# EAGLE design Zio Qwiic LoRa Dev Board (EAGLE 9.1.1)
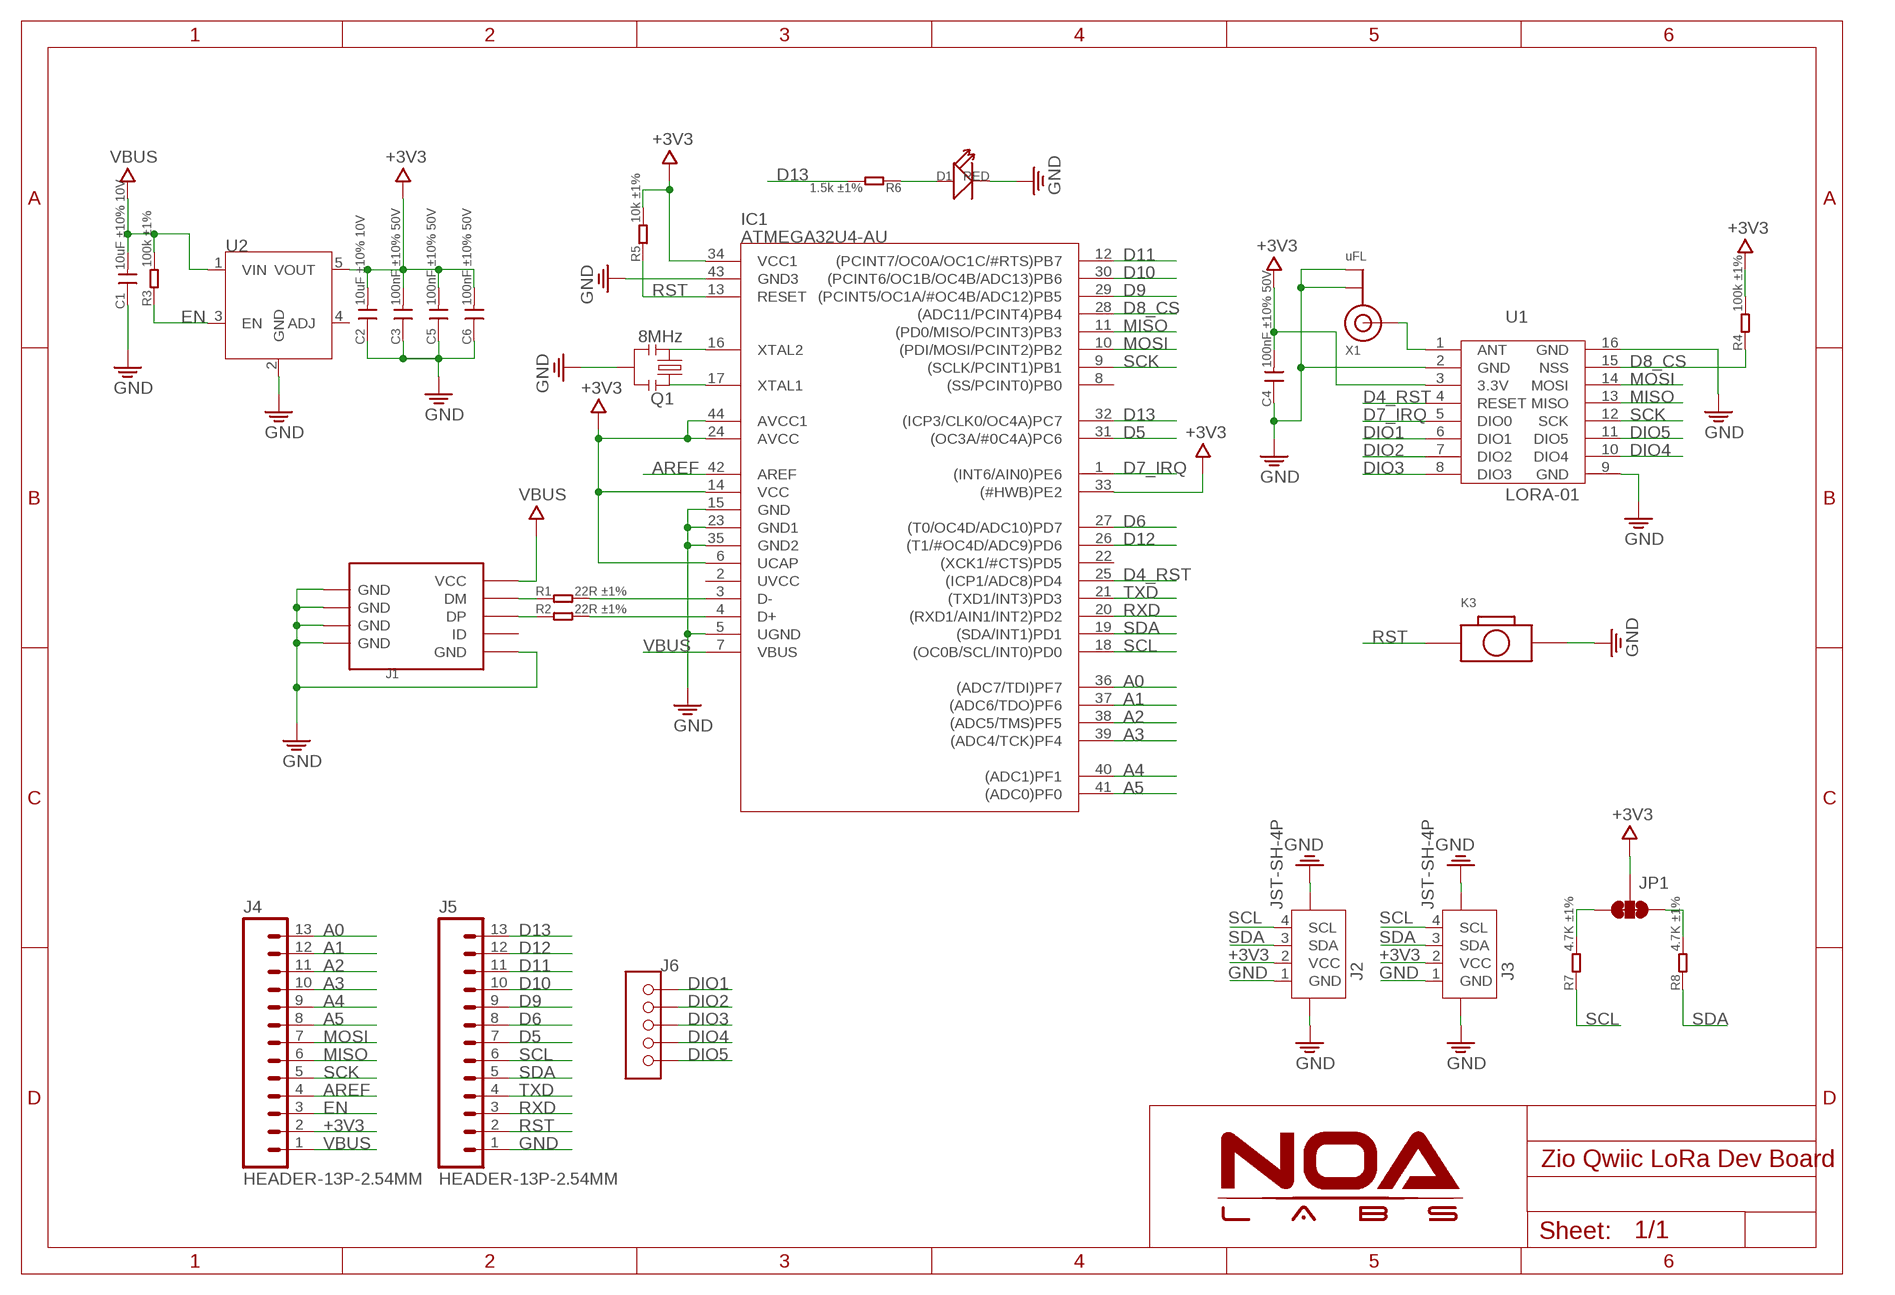
[diagram p0: schematic, sheet 1]

## Parts
C1  10uF ±10% 10V  C-0603  [C0603]
C2  10uF ±10% 10V  C-0603  [C0603]
C3  100nF ±10% 50V  C-0603  [C0603]
C4  100nF ±10% 50V  C-0603  [C0603]
C5  100nF ±10% 50V  C-0603  [C0603]
C6  100nF ±10% 50V  C-0603  [C0603]
D1  RED  LED'0603'  [LED-0603]
IC1  ATMEGA32U4-AU  ATMEGA32U4  [TQFP44]
J1  USB-MICROE  [MICRO-SMD]
J2  JST-SH-4P  [JST-SH-4P-90]
J3  JST-SH-4P  [JST-SH-4P-90]
J4  HEADER-13P-2.54MM  [13P-SCREW-2.54]
J5  HEADER-13P-2.54MM  [13P-SCREW-2.54]
J6  HEADER-5P-2.54  [5P-2.54]
JP1  SMT-JUMPER_3_2-NC_TRACE  [SMT-JUMPER_3_2-NC_TRACE]
K3  BOTTON-2PSKRKAEE020  [SKRKAEE020]
Q1  8MHz  RESONATORSMD  [RESONATOR-SMD]
R1  22R ±1%  R-0603  [R0603]
R2  22R ±1%  R-0603  [R0603]
R3  100k ±1%  R-0603  [R0603]
R4  100k ±1%  R-0603  [R0603]
R5  10k ±1%  R-0603  [R0603]
R6  1.5k ±1%  R-0603  [R0603]
R7  4.7K ±1%  R-0603  [R0603]
R8  4.7K ±1%  R-0603  [R0603]
U1  LORA-01  [LORA-01]
U2  AP2112  [SOT23-5]
X1  uFL  ANTENNA_U.FL  [U.FL]

## Nets
+3V3: C2.2 C3.2 C4.2 C5.2 C6.2 IC1.6(UCAP) IC1.14(VCC) IC1.24(AVCC) IC1.33((#HWB)PE2) IC1.34(VCC1) IC1.44(AVCC1) J2.2(VCC) J3.2(VCC) J4.2 JP1.2 R4.2 R5.2 U1.3(3.3V) U2.5(VOUT)
A0: IC1.36((ADC7/TDI)PF7) J4.13
A1: IC1.37((ADC6/TDO)PF6) J4.12
A2: IC1.38((ADC5/TMS)PF5) J4.11
A3: IC1.39((ADC4/TCK)PF4) J4.10
A4: IC1.40((ADC1)PF1) J4.9
A5: IC1.41((ADC0)PF0) J4.8
AREF: IC1.42(AREF) J4.4
D4_RST: IC1.25((ICP1/ADC8)PD4) U1.4(RESET)
D5: IC1.31((OC3A/#0C4A)PC6) J5.7
D6: IC1.27((T0/OC4D/ADC10)PD7) J5.8
D7_IRQ: IC1.1((INT6/AIN0)PE6) U1.5(DIO0)
D8_CS: IC1.28((ADC11/PCINT4)PB4) R4.1 U1.15(NSS)
D9: IC1.29((PCINT5/OC1A/#OC4B/ADC12)PB5) J5.9
D10: IC1.30((PCINT6/OC1B/OC4B/ADC13)PB6) J5.10
D11: IC1.12((PCINT7/OC0A/OC1C/#RTS)PB7) J5.11
D12: IC1.26((T1/#OC4D/ADC9)PD6) J5.12
D13: IC1.32((ICP3/CLK0/OC4A)PC7) J5.13 R6.2
DIO1: J6.1 U1.6(DIO1)
DIO2: J6.2 U1.7(DIO2)
DIO3: J6.3 U1.8(DIO3)
DIO4: J6.4 U1.10(DIO4)
DIO5: J6.5 U1.11(DIO5)
EN: J4.3 R3.1 U2.3(EN)
GND: C1.1 C2.1 C3.1 C4.1 C5.1 C6.1 D1.- IC1.5(UGND) IC1.15(GND) IC1.23(GND1) IC1.35(GND2) IC1.43(GND3) J1.GND J1.S1(GND) J1.S1@1(GND) J1.S1@2(GND) J1.S2(GND) J1.S2@1(GND) J1.S2@2(GND) J1.S3(GND) J1.S3@1(GND) J1.S3@2(GND) J1.S4(GND) J1.S4@1(GND) J1.S4@2(GND) J1.S5(GND) J1.S6(GND) J2.1(GND) J2.5 J2.6 J3.1(GND) J3.5 J3.6 J5.1 K3.2 Q1.2 U1.2(GND) U1.9(GND) U1.16(GND) U2.2(GND) X1.1(GND) X1.2(GND)
MISO: IC1.11((PD0/MISO/PCINT3)PB3) J4.6 U1.13(MISO)
MOSI: IC1.10((PDI/MOSI/PCINT2)PB2) J4.7 U1.14(MOSI)
N$1: J1.D-(DM) R1.1
N$2: J1.D+(DP) R2.1
N$3: IC1.4(D+) R2.2
N$4: IC1.3(D-) R1.2
N$6: IC1.16(XTAL2) Q1.3
N$7: D1.+ R6.1
N$8: IC1.17(XTAL1) Q1.1
N$18: U1.1(ANT) X1.3(SIGNAL)
N$34: JP1.3 R7.2
N$36: JP1.1 R8.2
RST: IC1.13(RESET) J5.2 K3.1 R5.1
RXD: IC1.20((RXD1/AIN1/INT2)PD2) J5.3
SCK: IC1.9((SCLK/PCINT1)PB1) J4.5 U1.12(SCK)
SCL: IC1.18((OC0B/SCL/INT0)PD0) J2.4(SCL) J3.4(SCL) J5.6 R7.1
SDA: IC1.19((SDA/INT1)PD1) J2.3(SDA) J3.3(SDA) J5.5 R8.1
TXD: IC1.21((TXD1/INT3)PD3) J5.4
VBUS: C1.2 IC1.7(VBUS) J1.VBUS(VCC) J4.1 R3.2 U2.1(VIN)
Unconnected: IC1.2(UVCC) IC1.8((SS/PCINT0)PB0) IC1.22((XCK1/#CTS)PD5) J1.ID U2.4(ADJ)

## Library data of the parts
C1-C6 = RCL:C
D1 = Discrete_NOA:LED*
IC1 = IC:ATMEGA32U4
J1 = Connector_NOA:USB-MICROE
J2 J3 = Connector:JST-SH-4P
J4 J5 = Connector:HEADER-13P
J6 = Connector:HEADER-5P
JP1 = NOA-Jumpers:SMT-JUMPER_3_2-NC_TRACE
K3 = Discrete:BOTTON-2P
Q1 = SparkFun:RESONATOR: Resonator Small SMD resonator. This is the itty bitty 10/20MHz resonators with built in caps. CSTCE10M0G55 and CSTCE20M0V53. Footprint has been reviewed closely but hasn't been tested yet.
R1-R8 = RCL:R
U1 = IC:LORA-01
U2 = IC_NOA:AP2112
X1 = microbuilder:ANTENNA_U.FL: U.FL Antenna Connector

## Board
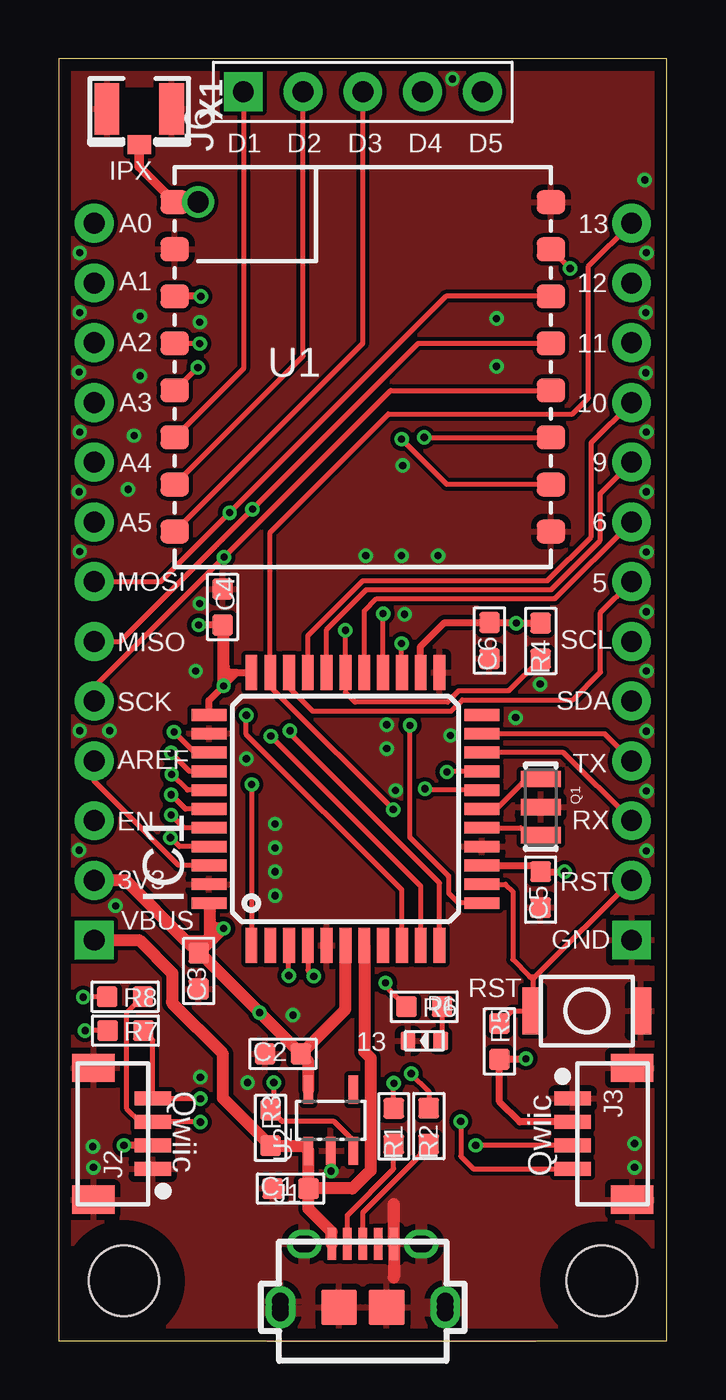
[diagram p1: board, top side]
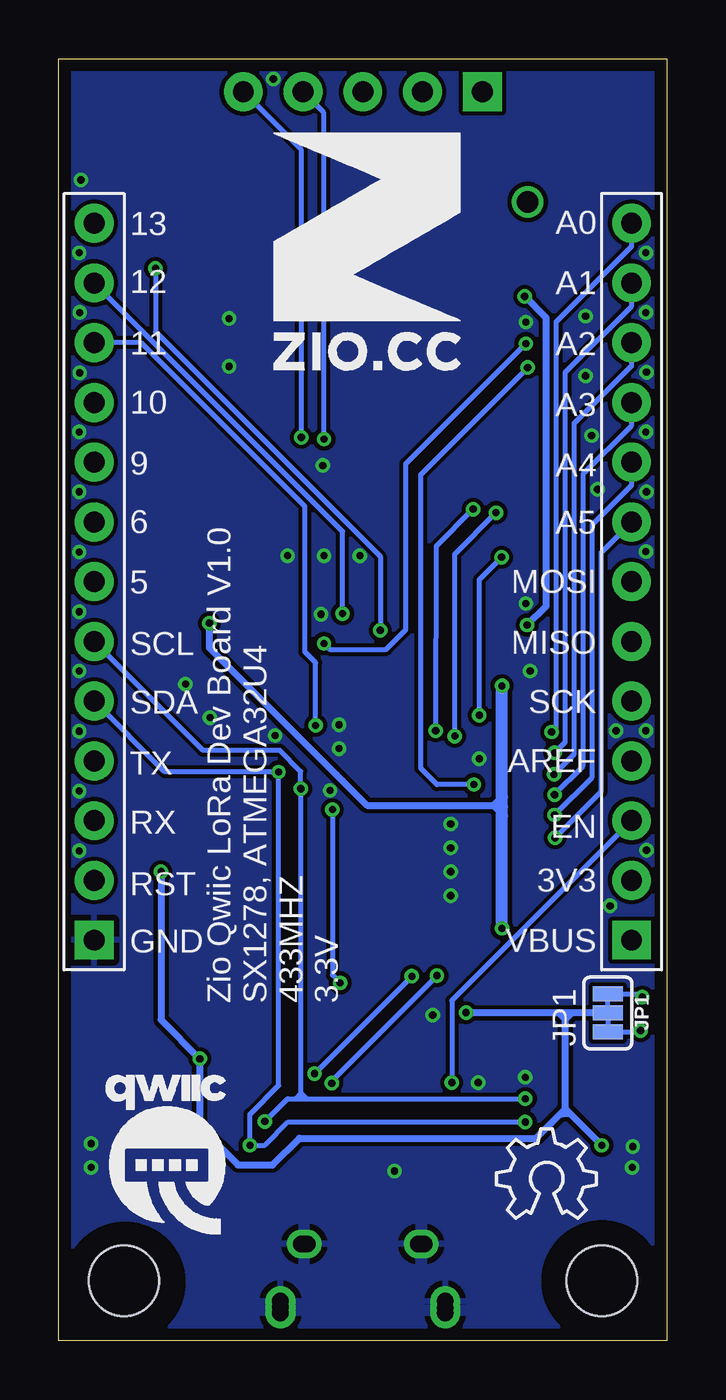
[diagram p2: board, bottom side, seen from below]

Size 25.86 x 54.5 mm. Coordinates in mm from the lower left corner, seen from the top.
Outline: 0,0 25.86,0 25.86,54.5 0,54.5 0,0
Copper layers (1*16): Top 0.035mm / dielectric 1.5mm / Bottom 0.035mm
Design rules "NOA Eagle Rule": minimum track width 7mil, minimum drill 12mil, track to track 7mil, track to pad 7mil, pad to pad 7mil, via to via 7mil, smd to smd 0mil, copper to edge 20mil, drill to drill 10mil, minimum pad ring 10mil, minimum via ring 6mil, stop-mask expansion 2mil, vias tented up to drill 25mil, thermal gap 10mil
Holes 3 mm at 2.77,2.54 23.09,2.54
tRestrict: area 0.3,0 to 5.3,5; area 20.6,0 to 25.6,5
bRestrict: area 0.3,0 to 5.3,5; area 20.6,0 to 25.6,5

### Footprints (pad centres in the part's own frame; a part is rotated, then mirrored left to right if it is on the bottom)
C0603 = smd 0.889 x 0.889: 1 -0.762,0; 2 0.762,0
LED-0603 = smd 0.635 x 0.8: + 0.699,0; - -0.699,0
TQFP44 = smd 1.5 x 0.5: 1 -5.8,4; 2 -5.8,3.2; 3 -5.8,2.4; 4 -5.8,1.6; 5 -5.8,0.8; 6 -5.8,0; 7 -5.8,-0.8; 8 -5.8,-1.6; 9 -5.8,-2.4; 10 -5.8,-3.2; 11 -5.8,-4; 23 5.8,-4; 24 5.8,-3.2; 25 5.8,-2.4; 26 5.8,-1.6; 27 5.8,-0.8; 28 5.8,0; 29 5.8,0.8; 30 5.8,1.6; 31 5.8,2.4; 32 5.8,3.2; 33 5.8,4 | smd 0.5 x 1.5: 12 -4,-5.8; 13 -3.2,-5.8; 14 -2.4,-5.8; 15 -1.6,-5.8; 16 -0.8,-5.8; 17 0,-5.8; 18 0.8,-5.8; 19 1.6,-5.8; 20 2.4,-5.8; 21 3.2,-5.8; 22 4,-5.8; 34 4,5.8; 35 3.2,5.8; 36 2.4,5.8; 37 1.6,5.8; 38 0.8,5.8; 39 0,5.8; 40 -0.8,5.8; 41 -1.6,5.8; 42 -2.4,5.8; 43 -3.2,5.8; 44 -4,5.8
MICRO-SMD = smd 0.406 x 1.346: D+ 0,2.057; D- -0.66,2.057; GND 1.321,2.057; ID 0.66,2.057; VBUS -1.321,2.057 | drill 0.7: S1 -2.489,2.057; S1@1 -2.616,2.057; S1@2 -2.362,2.057; S2 2.464,2.057; S2@1 2.362,2.057; S2@2 2.616,2.057 | drill 0.7 pad 1.27: S3 -3.505,-0.66; S3@1 -3.505,-0.381; S3@2 -3.505,-0.889; S4 3.505,-0.635; S4@1 3.505,-0.381; S4@2 3.505,-0.889 | smd 1.524 x 1.524: S5 -1.016,-0.635; S6 1.016,-0.635
JST-SH-4P-90 = smd 0.6 x 1.55: 1 -1.5,0; 2 -0.5,0; 3 0.5,0; 4 1.5,0 | smd 1.2 x 1.8: 5 -2.8,2.525; 6 2.8,2.525
13P-SCREW-2.54 = drill 0.889 pad 1.651 square: 1 0,13.97 | drill 0.889 pad 1.651: 2 0,11.43; 3 0,8.89; 4 0,6.35; 5 0,3.81; 6 0,1.27; 7 0,-1.27; 8 0,-3.81; 9 0,-6.35; 10 0,-8.89; 11 0,-11.43; 12 0,-13.97; 13 0,-16.51
5P-2.54 = drill 0.889 pad 1.651 square: 1 0,5.08 | drill 0.889 pad 1.651: 2 0,2.54; 3 0,0; 4 0,-2.54; 5 0,-5.08
SMT-JUMPER_3_2-NC_TRACE = smd 0.635 x 1.27: 1 -0.813,0; 2 0,0; 3 0.813,0
SKRKAEE020 = smd 0.87 x 2: 1 -2.3,0; 2 2.3,0
RESONATOR-SMD = smd 0.7 x 1.7: 1 -1.2,0; 2 0,0; 3 1.2,0
R0603 = smd 0.889 x 0.889: 1 -0.762,0; 2 0.762,0
LORA-01 = smd 1.2 x 1: 1 -8,7; 2 -8,5; 3 -8,3; 4 -8,1; 5 -8,-1; 6 -8,-3; 7 -8,-5; 8 -8,-7; 9 8,-7; 10 8,-5; 11 8,-3; 12 8,-1; 13 8,1; 14 8,3; 15 8,5; 16 8,7
SOT23-5 = smd 0.4 x 1.2: 1 -0.95,-1.3; 2 0,-1.3; 3 0.95,-1.3; 4 0.95,1.3; 5 -0.95,1.3
U.FL = smd 2.2 x 1.05: 1 0,1.375; 2 0,-1.375 | smd 0.8 x 1: 3 1.525,0

### Placement (x,y rotation side)
C1  9.86,6.47 0 top
C2  9.53,12.19 0 top
C3  5.95,15.72 90 top
C4  6.97,31.19 270 top
C5  20.49,19.18 90 top
C6  18.32,29.77 90 top
D1  15.54,12.75 0 top
IC1  12.19,22.61 90 top
J1  12.93,2.06 0 top
J2  4,8.8 90 top
J3  21.86,8.8 270 top
J4  1.5,31 180 bottom
J5  24.36,31 180 bottom
J6  12.93,53.09 90 top
JP1  2.51,13.93 270 bottom
K3  22.46,14.01 0 top
Q1  20.5,22.68 270 top
R1  14.24,9.11 90 top
R2  15.74,9.12 90 top
R3  9.01,9.05 270 top
R4  20.5,29.75 90 top
R5  18.74,12.72 270 top
R6  15.54,14.2 180 top
R7  2.84,13.18 180 top
R8  2.82,14.62 180 top
U1  12.93,41.4 0 top
U2  11.57,9.38 0 top
U$10  [10MM]  16.74,41.27 0 bottom
U$11  [QWIIC-LOGO-MEDIUM]  21.31,7.98 0 bottom
U$12  [OSHW_6X150_NOTEXT]  7.24,5.21 0 bottom
X1  3.42,52.37 270 top

### Tracks (layer width: path | path; a pad name or v marks a point on that pad's centre or on a via)
+3V3  (via drill 0.3)
  Top 0.305: 7.58,28.41 v7.01,27.84 6.39,27.22 IC1.34 | 7.58,28.41 IC1.33 | 7.58,28.41 7.26,28.41 7.01,28.65 | C4.2 v5.94,30.43 | v5.94,30.43 | v6.04,44.4 U1.3 | IC1.24 15.39,29.51 16.41,30.53 C6.2 19.43,30.53 v19.46,30.5 v19.46,30.51 R4.2 | IC1.14 20.22,20.21 C5.2 v21.51,19.94 | J3.2 19.61,9.3 18.74,10.16 R5.2 19.84,11.96 v19.86,11.99 | J2.2 v2.77,8.3 v2.77,8.31
  Top 0.508: U2.5 10.62,11.87 C2.2 | C2.2 12.19,14.09 IC1.6 | C2.2 v8.54,13.95 6.01,16.48 C3.2 | C3.2 5.42,17.01 | 5.42,17.01 2.86,19.57 J4.2 | C3.2 6.42,16.95 | 6.42,16.95 7,17.53 v7.01,17.53 6.62,17.53 6.42,17.73 | v7.01,27.84 7.01,28.65 7.01,30.38 C4.2 | 5.42,17.01 6.36,17.01 6.42,16.95 | IC1.44 6.42,18.58 6.42,17.73 | 6.42,17.73 6.42,16.95
  Bottom 0.305: JP1.2 4.12,13.93 | 4.12,13.93 4.6,13.93 | 4.6,13.93 8.52,13.93 v8.54,13.95 | v5.94,30.43 5.13,31.24 5.13,43.48 v6.04,44.4 | v2.77,8.31 4.1,9.64 | 4.1,9.64 4.32,9.86 | 4.32,13.65 4.6,13.93 | 4.32,9.86 4.32,13.65 | 4.32,13.65 4.12,13.86 4.12,13.93 | v19.46,30.5 19.46,29.46 18.49,28.5 18.17,28.18 14.05,24.05 13.79,23.8 12.75,22.76 7.42,22.76 | 7.01,22.71 7.06,22.76 7.42,22.76 | 7.42,22.76 7.37,22.76 | 7.37,22.76 7.01,23.11 | 7.37,22.76 7.01,22.4 7.01,22.33 | v21.51,19.94 21.51,13.64 v19.86,11.99 19.86,9.09 18.24,7.47 16.76,7.47 15.62,8.61 5.56,8.61 4.5,9.68 | 4.5,9.68 4.32,9.86 | 4.1,9.64 4.46,9.64 4.5,9.68
  Bottom 0.508: v7.01,17.53 7.01,22.33 7.01,22.71 7.01,23.11 v7.01,27.84
A0  (via drill 0.3)
  Top 0.203: IC1.36 5.78,25.01 v4.9,25.88
  Bottom 0.203: v4.9,25.88 4.7,26.09 4.7,43.33 1.5,46.53 J4.13
A1  (via drill 0.3)
  Top 0.203: IC1.37 5.56,24.21 v4.78,24.99
  Bottom 0.203: v4.78,24.99 4.32,25.45 4.32,41.17 1.5,43.99 J4.12
A2  (via drill 0.3)
  Top 0.203: IC1.38 5.47,23.41 v4.8,24.08
  Bottom 0.203: v4.8,24.08 3.94,24.94 3.94,39.02 1.5,41.45 J4.11
A3  (via drill 0.3)
  Top 0.203: IC1.39 5.38,22.61 v4.78,23.22
  Bottom 0.203: v4.78,23.22 3.56,24.43 3.56,36.86 1.5,38.91 J4.10
A4  (via drill 0.3)
  Top 0.203: IC1.40 5.32,21.81 v4.78,22.35
  Bottom 0.203: v4.78,22.35 3.17,23.95 3.17,34.7 1.5,36.37 J4.9
A5  (via drill 0.3)
  Top 0.203: IC1.41 5.13,21.01 v4.75,21.39
  Bottom 0.203: v4.75,21.39 2.79,23.34 2.79,33.52 J4.8
AREF
  Top 0.203: IC1.42 5.09,20.21 1.5,23.8 J4.4
D4_RST  (via drill 0.3)
  Top 0.203: IC1.25 v14.58,29.64 | v5.99,42.39 U1.4
  Bottom 0.203: v5.99,42.39 11.1,37.29 11.1,30.23 11.94,29.39 14.33,29.39 v14.58,29.64
D5
  Top 0.203: J5.7 23.04,30.95 23.04,28.42 21.86,27.24 17.16,27.24 16.69,26.77 10.79,26.77 9.79,27.77 IC1.31
D6
  Top 0.203: IC1.27 12.99,31.03 13.51,31.55 19.68,31.55 21.1,31.55 J5.8
D7_IRQ  (via drill 0.3)
  Top 0.203: U1.5 5.91,41.38 v5.92,41.38 | v8.2,23.65 8.2,16.82 IC1.1
  Bottom 0.203: v5.92,41.38 10.46,36.83 10.46,24.33 9.78,23.65 v8.2,23.65
D8_CS  (via drill 0.3)
  Top 0.203: v21.74,45.59 U1.15 | v12.19,30.2 IC1.28 12.19,27.56 12.6,27.15 16.53,27.15 17,27.62 19.13,27.62 R4.1
  Bottom 0.203: v12.19,30.2 12.19,33.34 21.74,42.89 v21.74,45.59
D9
  Top 0.203: J5.9 23.03,36.02 23.03,34.02 20.94,31.93 14.28,31.93 13.09,31.93 11.39,30.23 IC1.29
D10
  Top 0.203: J5.10 22.65,38.18 22.65,34.18 20.78,32.31 13.92,32.31 12.93,32.31 10.59,29.97 IC1.30
D11  (via drill 0.3)
  Top 0.203: IC1.12 17,18.61 16.59,19.02 16.59,19.68 16.57,19.7 16.57,19.77 14.94,21.4 v14.94,26.16
  Bottom 0.203: v14.94,26.16 14.94,28.83 15.39,29.29 15.39,35.46 22.36,42.43 J5.11
D12  (via drill 0.3)
  Top 0.203: IC1.26 v13.79,30.91 | v13.79,30.91
  Bottom 0.203: v13.79,30.91 13.79,34.4 J5.12
D13  (via drill 0.3)
  Top 0.203: J5.13 22.53,45.68 22.53,40.08 21.84,39.4 14.02,39.4 8.99,34.37 IC1.32 8.99,27.81 9.43,27.38 v14.22,22.58 | v13.89,15.21 13.89,15.09 R6.2
  Bottom 0.203: v14.22,22.58 14.22,15.54 v13.89,15.21
DIO1
  Top 0.203: J6.1 7.85,41.32 U1.6
DIO2
  Top 0.203: U1.7 10.39,41.86 J6.2
DIO3
  Top 0.203: U1.8 12.93,42.4 J6.3
DIO4  (via drill 0.3)
  Top 0.203: U1.10 16.51,36.4 v14.58,38.33
  Bottom 0.203: v14.58,38.33 14.58,52.2 J6.4
DIO5  (via drill 0.3)
  Top 0.203: U1.11 v15.55,38.4 v15.54,38.41
  Bottom 0.203: v15.54,38.41 15.54,50.63 J6.5
EN  (via drill 0.3)
  Top 0.203: U2.3 12.52,8.51 11.71,9.32 9.5,9.32 R3.1 9.14,9.95 v9.14,10.97
  Bottom 0.203: J4.3 9.14,14.47 v9.14,10.97
GND  (via drill 0.3)
  Top 0.305: U2.2 11.57,7.23 v11.58,7.21
  Top 0.508: 14.25,5.82 J1.GND 14.25,2.69
  other vias: 0.86,20.85 0.89,25.93 0.89,33.55 0.86,36.09 0.89,38.63 0.86,41.17 0.89,43.71 0.89,46.25 24.99,46.25 24.97,43.71 24.97,41.15 24.99,33.53 24.92,49.35 16.74,53.64 2.16,25.93 7.98,24.74 16.66,25.73 13.94,26.19 24.99,38.63 24.99,36.09 24.99,30.99 24.99,25.91 24.99,23.37 24.99,20.83 8.03,10.97 6.02,11.2 1.47,7.37 1.45,8.26 2.41,18.49 13.06,33.38 14.58,33.38 16.13,33.38 14.71,30.89 24.99,28.47 9.19,21.97 24.49,7.37 24.49,8.38 5.99,43.31 5.99,31.34 20.47,27.91 19.43,26.49 18.62,43.46 18.62,41.43 3.45,43.56 3.45,41.02 3.2,38.48 2.95,36.2 14.63,37.21 9.96,13.84 13.94,25.17 9.19,20.95 9.19,19.94 9.19,18.92 5.82,28.47 14.33,23.39
  pour Top: 0,54.51 25.86,54.51 25.86,0 0,0
  pour Bottom: 0,54.51 25.86,54.51 25.86,0 0,0
MISO  (via drill 0.3)
  Top 0.203: IC1.11 16.19,19.46 9.83,25.82 v9.83,25.93 | J4.6 2.62,29.73 v8.24,35.35 15.29,42.4 U1.13
  Bottom 0.203: v9.83,25.93 9.8,33.78 v8.24,35.35
MOSI  (via drill 0.3)
  Top 0.203: J4.7 4.33,32.27 v7.26,35.2 16.46,44.4 U1.14 | v9.02,25.7 15.39,19.33 IC1.10
  Bottom 0.203: v9.02,25.7 9.02,33.45 v7.26,35.2
N$1
  Top 0.203: J1.D- 12.27,5.33 14.24,7.31 R1.1
N$2
  Top 0.203: J1.D+ 12.93,5.46 15.74,8.26 R2.1
N$3  (via drill 0.3)
  Top 0.203: IC1.4 10.59,15.75 v10.85,15.49 | v14.99,11.35 15.74,10.6 R2.2
  Bottom 0.203: v10.85,15.49 v14.99,11.35
N$4  (via drill 0.3)
  Top 0.203: v9.78,15.52 9.78,16.79 IC1.3 | R1.2 v14.24,10.94 v14.25,10.95
  Bottom 0.203: v9.78,15.52 14.25,11.05 v14.25,10.95
N$6
  Top 0.203: IC1.16 19.65,21.81 19.97,21.48 Q1.3
N$7
  Top 0.203: D1.+ 16.31,12.81 R6.1
N$8
  Top 0.203: IC1.17 18.62,22.61 19.89,23.88 Q1.1
N$18  (via drill 0.9)
  Top 0.406: X1.3 3.42,49.91 U1.1 v5.91,48.4 v5.92,48.41
N$34  (via drill 0.3)
  Top 0.203: R7.2 v1.12,13.18
  Bottom 0.203: JP1.3 1.18,13.12 v1.12,13.18
N$36  (via drill 0.3)
  Top 0.203: R8.2 1.06,14.62 v1.04,14.61
  Bottom 0.203: JP1.1 1.18,14.75 v1.04,14.61
RST
  Top 0.203: J5.2 20.28,15.49 | 20.28,15.49 20.16,15.37 | 20.16,15.37 K3.1 19.27,14.01 R5.1 | IC1.13 19,19.41 19.3,19.1 19.3,16.2 19.99,15.52 20.02,15.49 | 20.02,15.49 20.14,15.37 20.16,15.37 | 20.02,15.49 20.28,15.49
RXD
  Top 0.203: J5.3 21.46,25.01 IC1.20
SCK  (via drill 0.3)
  Top 0.203: U1.12 14.11,40.4 v7.02,33.31 1.5,27.79 J4.5 | IC1.9 14.59,19.16 7.98,25.78 v7.98,26.59
  Bottom 0.203: v7.98,26.59 7.98,32.36 v7.02,33.31
SCL  (via drill 0.3)
  Top 0.203: J2.4 4,12.79 R7.1 | 4.01,10.29 J2.4 | IC1.18 15.63,23.41 v15.57,23.47 | J3.4 17.64,7.3 17.09,7.85 v17.09,9.32 | v6.02,10.29 4.01,10.29 | 4.01,10.29 J2.4
  Bottom 0.203: v17.09,9.32 16.13,10.29 15.8,10.29 | 15.8,10.29 15.32,10.29 | J5.6 19.73,25.09 16.46,25.09 15.57,24.21 v15.57,23.47 15.57,10.54 | 15.57,10.54 15.32,10.29 | 15.57,10.54 15.57,10.52 15.8,10.29 | 15.32,10.29 v6.02,10.29
SDA  (via drill 0.3)
  Top 0.203: J3.3 | R8.1 2.87,13.91 2.87,9.88 3.45,9.3 J2.3 v6.02,9.3 | IC1.19 16.54,24.21 v16.51,24.18 | J3.3 v17.73,8.31
  Bottom 0.203: J5.5 21.35,24.18 v16.51,24.18 16.51,10.85 17.73,9.63 v17.73,8.31 17.09,8.31 16.1,9.3 v6.02,9.3
TXD
  Top 0.203: J5.4 23.2,25.81 IC1.21
VBUS
  Top 0.508: C1.2 U2.1 | U2.1 | U2.1 10.4,8.29 R3.2 6.99,10.31 6.99,12.19 4.83,14.35 4.83,14.48 4.83,15.62 3.42,17.03 J4.1 | C1.2 12.49,6.47 13.26,7.24 13.26,12.01 12.99,12.28 IC1.7 | J1.VBUS 11.61,4.62 10.62,5.61 C1.2

### Text on the board
tPlace: D1 | D2 | D3 | D4 | D5 | IPX | 13 | A0 | A1 | 12 | 11 | A2 | 10 | A3 | 9 | A4 | 6 | A5 | 5 | MOSI | SCL | MISO | SDA | SCK | TX | AREF | RX | EN | RST | 3V3 | VBUS | GND | RST | 13 | Qwiic | Qwiic
bPlace: A0 | 13 | A1 | 12 | A2 | 11 | A3 | 10 | A4 | 9 | A5 | 6 | MOSI | 5 | MISO | SCL | SCK | SDA | AREF | TX | EN | RX | 3V3 | RST | VBUS | GND | Zio Qwiic LoRa Dev Board V1.0 / SX1278, ATMEGA32U4 / 433MHZ / 3.3V | JP1